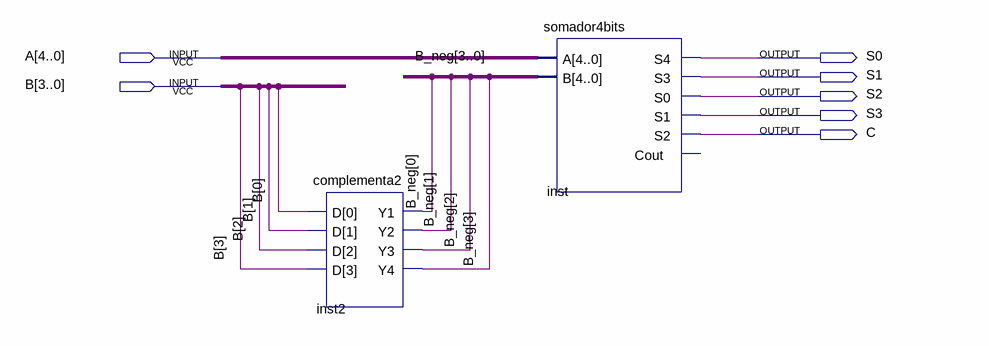
[diagram p0: schematic sheet]
// Quartus schematic subtrator4bit.bdf as structural Verilog: 2 symbols, 7 pins
module subtrator4bit (
  input  [4:0] A,
  input  [3:0] B,
  output S0,
  output S1,
  output S2,
  output S3,
  output C
);

  wire [3:0] B_neg;

  complementa2 inst2 (.D(B), .Y1(B_neg[0]), .Y2(B_neg[1]), .Y3(B_neg[2]), .Y4(B_neg[3]));
  somador4bits inst (.A(A), .B(B_neg), .S4(S0), .S3(S1), .S0(S2), .S1(S3), .S2(C));  // open: Cout
endmodule
